# EAGLE design kinx (EAGLE 8.4.3)

## Sheet 1 of 4: keyboard matrix
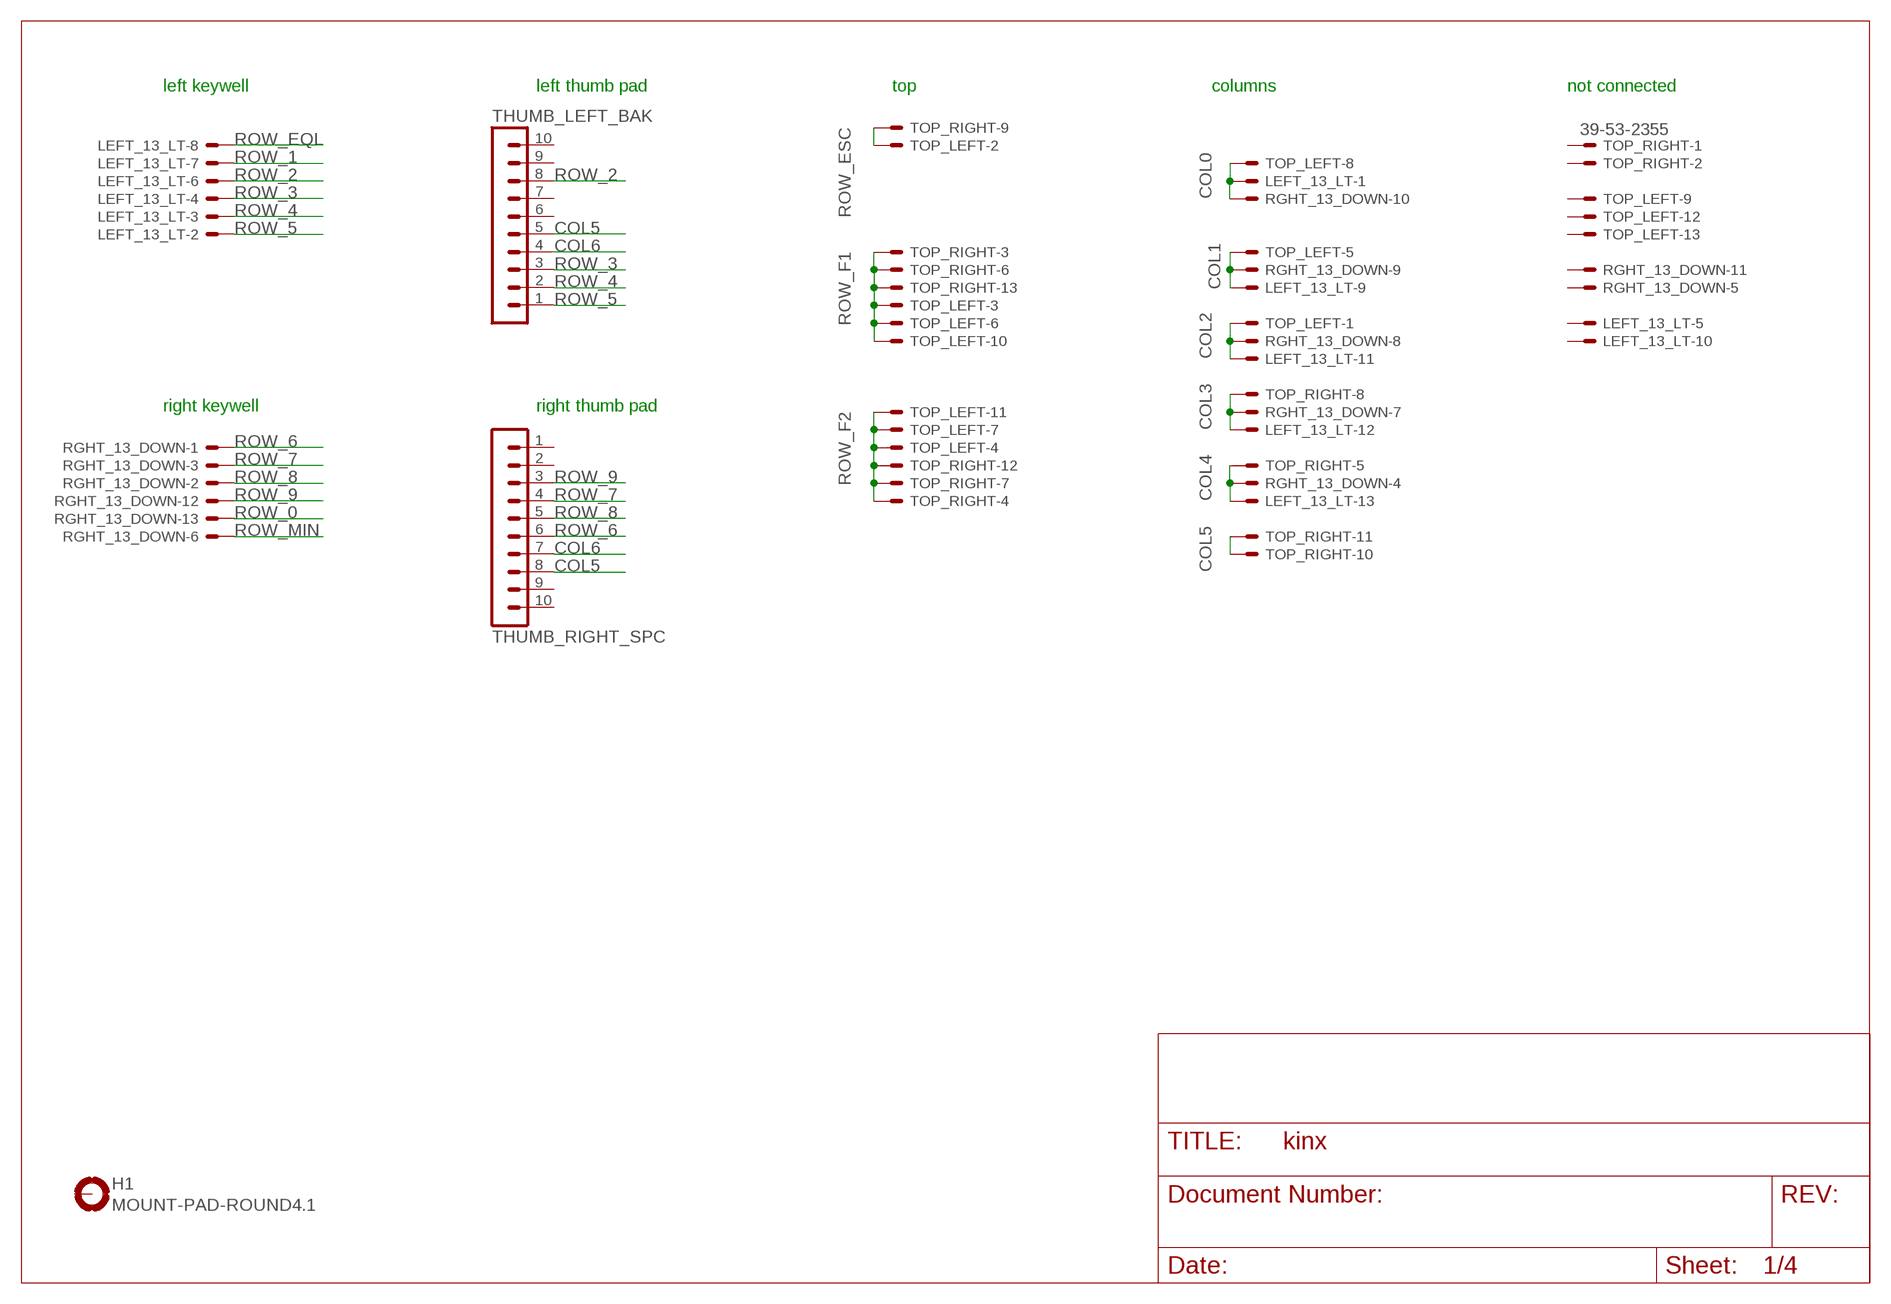
[diagram p0: schematic, sheet 1]

### Parts
H1  MOUNT-PAD-ROUND4.1  [4,1-PAD]
LEFT_13_LT  39-53-2355  [39-53-2135]
RGHT_13_DOWN  39-53-2355  [39-53-2135]
THUMB_LEFT_BAK  MA10-1  [MA10-1]
THUMB_RIGHT_SPC  MA10-1  [MA10-1]
TOP_LEFT  39-53-2355  [39-53-2135]
TOP_RIGHT  39-53-2355  [39-53-2135]

### Nets
COL0: LEFT_13_LT.P$1 RGHT_13_DOWN.P$10 TOP_LEFT.P$8 ; also sheet 3
COL1: LEFT_13_LT.P$9 RGHT_13_DOWN.P$9 TOP_LEFT.P$5 ; also sheet 3
COL2: LEFT_13_LT.P$11 RGHT_13_DOWN.P$8 TOP_LEFT.P$1 ; also sheet 3
COL3: LEFT_13_LT.P$12 RGHT_13_DOWN.P$7 TOP_RIGHT.P$8 ; also sheet 3
COL4: LEFT_13_LT.P$13 RGHT_13_DOWN.P$4 TOP_RIGHT.P$5 ; also sheet 3
COL5: THUMB_LEFT_BAK.5 THUMB_RIGHT_SPC.8 TOP_RIGHT.P$10 TOP_RIGHT.P$11 ; also sheet 3
COL6: THUMB_LEFT_BAK.4 THUMB_RIGHT_SPC.7 ; also sheet 3
ROW_0: RGHT_13_DOWN.P$13 ; also sheet 3
ROW_1: LEFT_13_LT.P$7 ; also sheet 3
ROW_2: LEFT_13_LT.P$6 THUMB_LEFT_BAK.8 ; also sheet 3
ROW_3: LEFT_13_LT.P$4 THUMB_LEFT_BAK.3 ; also sheet 3
ROW_4: LEFT_13_LT.P$3 THUMB_LEFT_BAK.2 ; also sheet 3
ROW_5: LEFT_13_LT.P$2 THUMB_LEFT_BAK.1 ; also sheet 3
ROW_6: RGHT_13_DOWN.P$1 THUMB_RIGHT_SPC.6 ; also sheet 3
ROW_7: RGHT_13_DOWN.P$3 THUMB_RIGHT_SPC.4 ; also sheet 3
ROW_8: RGHT_13_DOWN.P$2 THUMB_RIGHT_SPC.5 ; also sheet 3
ROW_9: RGHT_13_DOWN.P$12 THUMB_RIGHT_SPC.3 ; also sheet 3
ROW_EQL: LEFT_13_LT.P$8 ; also sheet 3
ROW_ESC: TOP_LEFT.P$2 TOP_RIGHT.P$9 ; also sheet 3
ROW_F1: TOP_LEFT.P$3 TOP_LEFT.P$6 TOP_LEFT.P$10 TOP_RIGHT.P$3 TOP_RIGHT.P$6 TOP_RIGHT.P$13 ; also sheet 3
ROW_F2: TOP_LEFT.P$4 TOP_LEFT.P$7 TOP_LEFT.P$11 TOP_RIGHT.P$4 TOP_RIGHT.P$7 TOP_RIGHT.P$12 ; also sheet 3
ROW_MIN: RGHT_13_DOWN.P$6 ; also sheet 3
Unconnected: H1.B4,1(MOUNT) LEFT_13_LT.P$5 LEFT_13_LT.P$10 RGHT_13_DOWN.P$5 RGHT_13_DOWN.P$11 THUMB_LEFT_BAK.6 THUMB_LEFT_BAK.7 THUMB_LEFT_BAK.9 THUMB_LEFT_BAK.10 THUMB_RIGHT_SPC.1 THUMB_RIGHT_SPC.2 THUMB_RIGHT_SPC.9 THUMB_RIGHT_SPC.10 TOP_LEFT.P$9 TOP_LEFT.P$12 TOP_LEFT.P$13 TOP_RIGHT.P$1 TOP_RIGHT.P$2

### Notes on the sheet
- left keywell | left thumb pad | top | columns | not connected
- right keywell | right thumb pad

## Sheet 2 of 4: LEDs
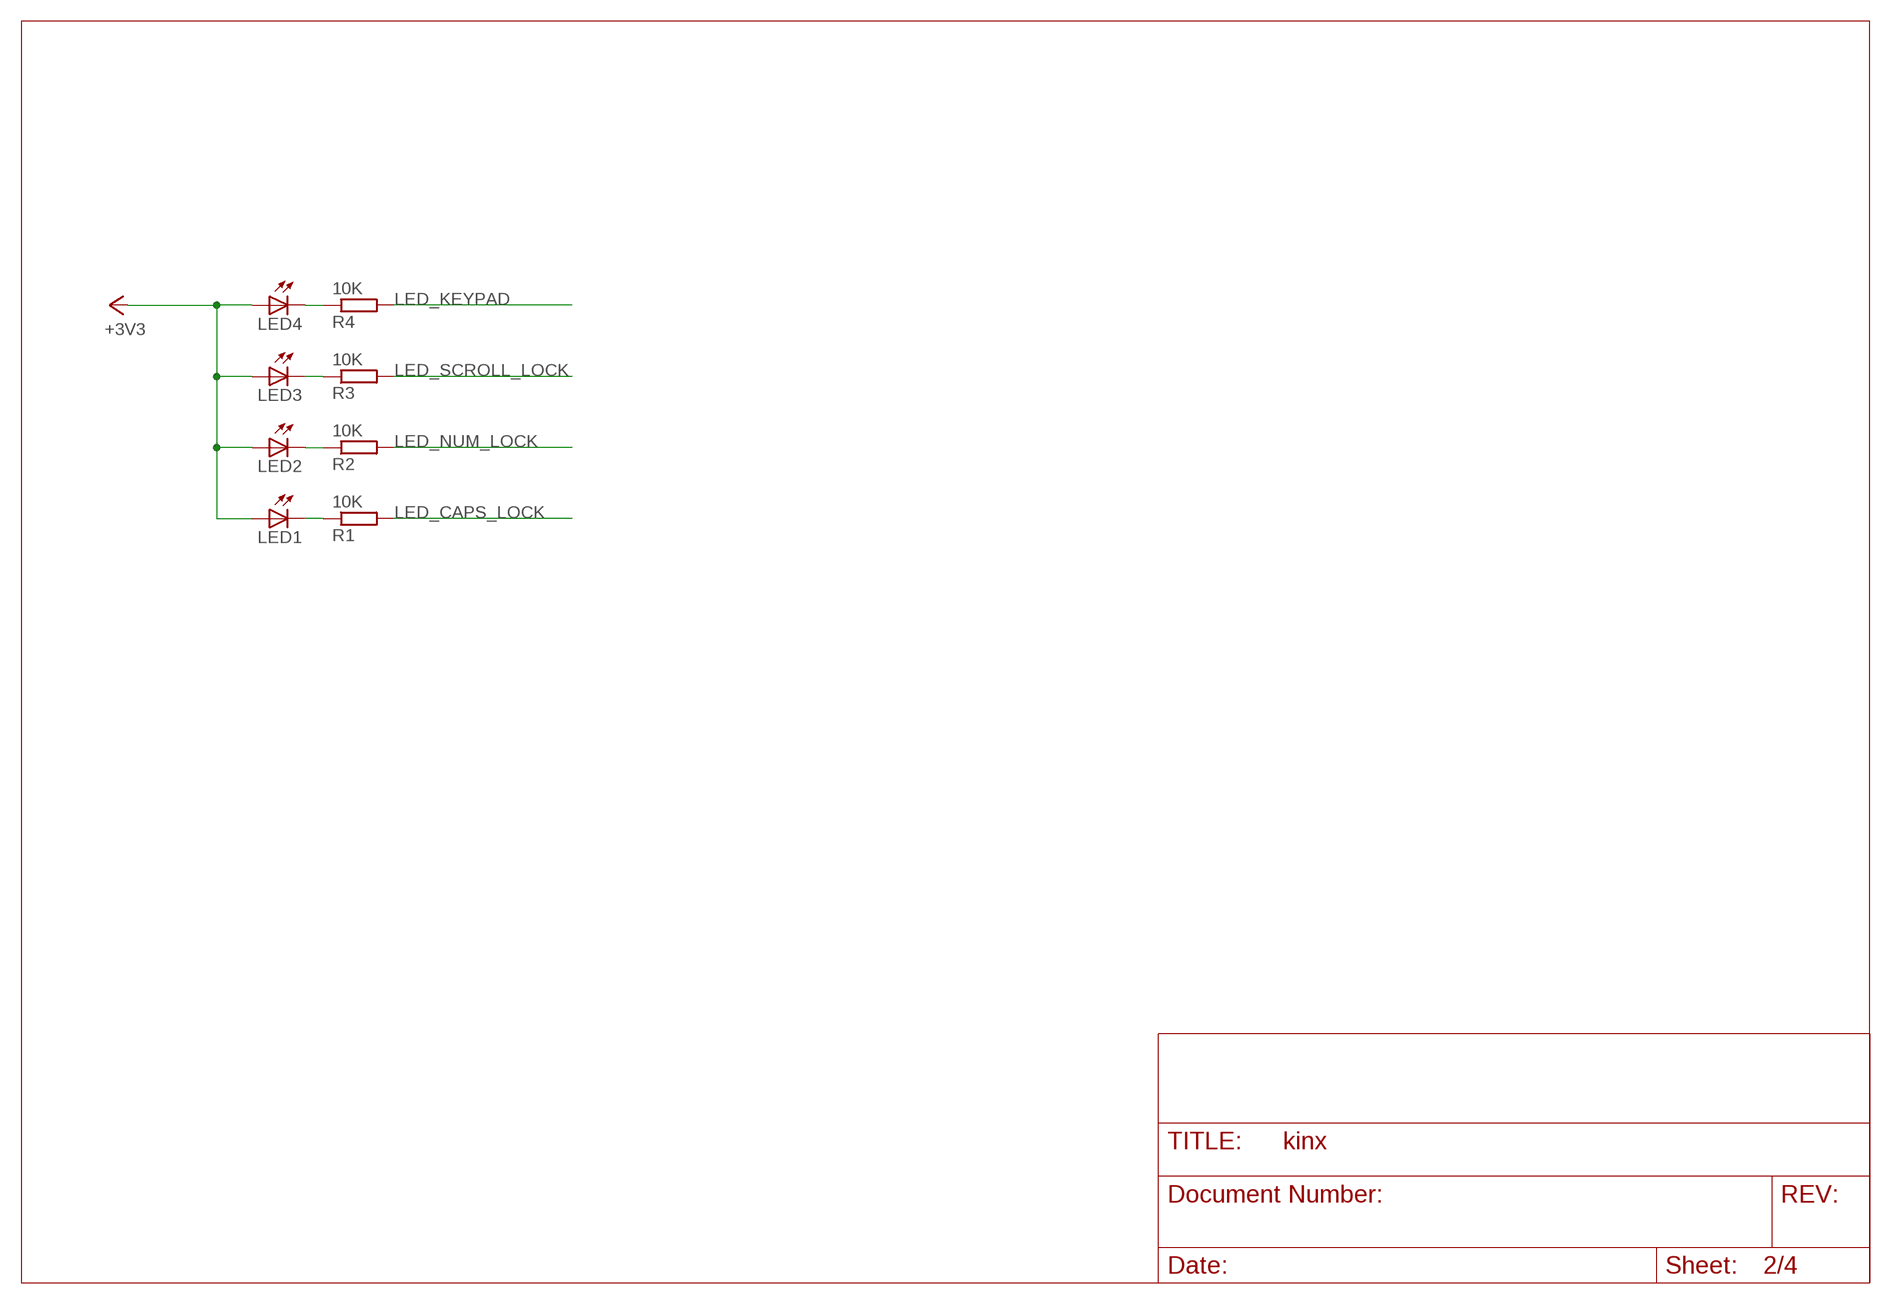
[diagram p1: schematic, sheet 2]

### Parts
LED1  LEDSML1206  [SML1206]
LED2  LEDSML1206  [SML1206]
LED3  LEDSML1206  [SML1206]
LED4  LEDSML1206  [SML1206]
R1  10K  R-EU_R1206  [R1206]
R2  10K  R-EU_R1206  [R1206]
R3  10K  R-EU_R1206  [R1206]
R4  10K  R-EU_R1206  [R1206]

### Nets
+3V3 [power]: LED1.A LED2.A LED3.A LED4.A ; also sheet 3,4
LED_CAPS_LOCK: R1.2 ; also sheet 3
LED_KEYPAD: R4.2 ; also sheet 3
LED_NUM_LOCK: R2.2 ; also sheet 3
LED_SCROLL_LOCK: R3.2 ; also sheet 3
N$14: LED4.C R4.1
N$15: LED3.C R3.1
N$16: LED2.C R2.1
N$17: LED1.C R1.1

## Sheet 3 of 4: microcontroller
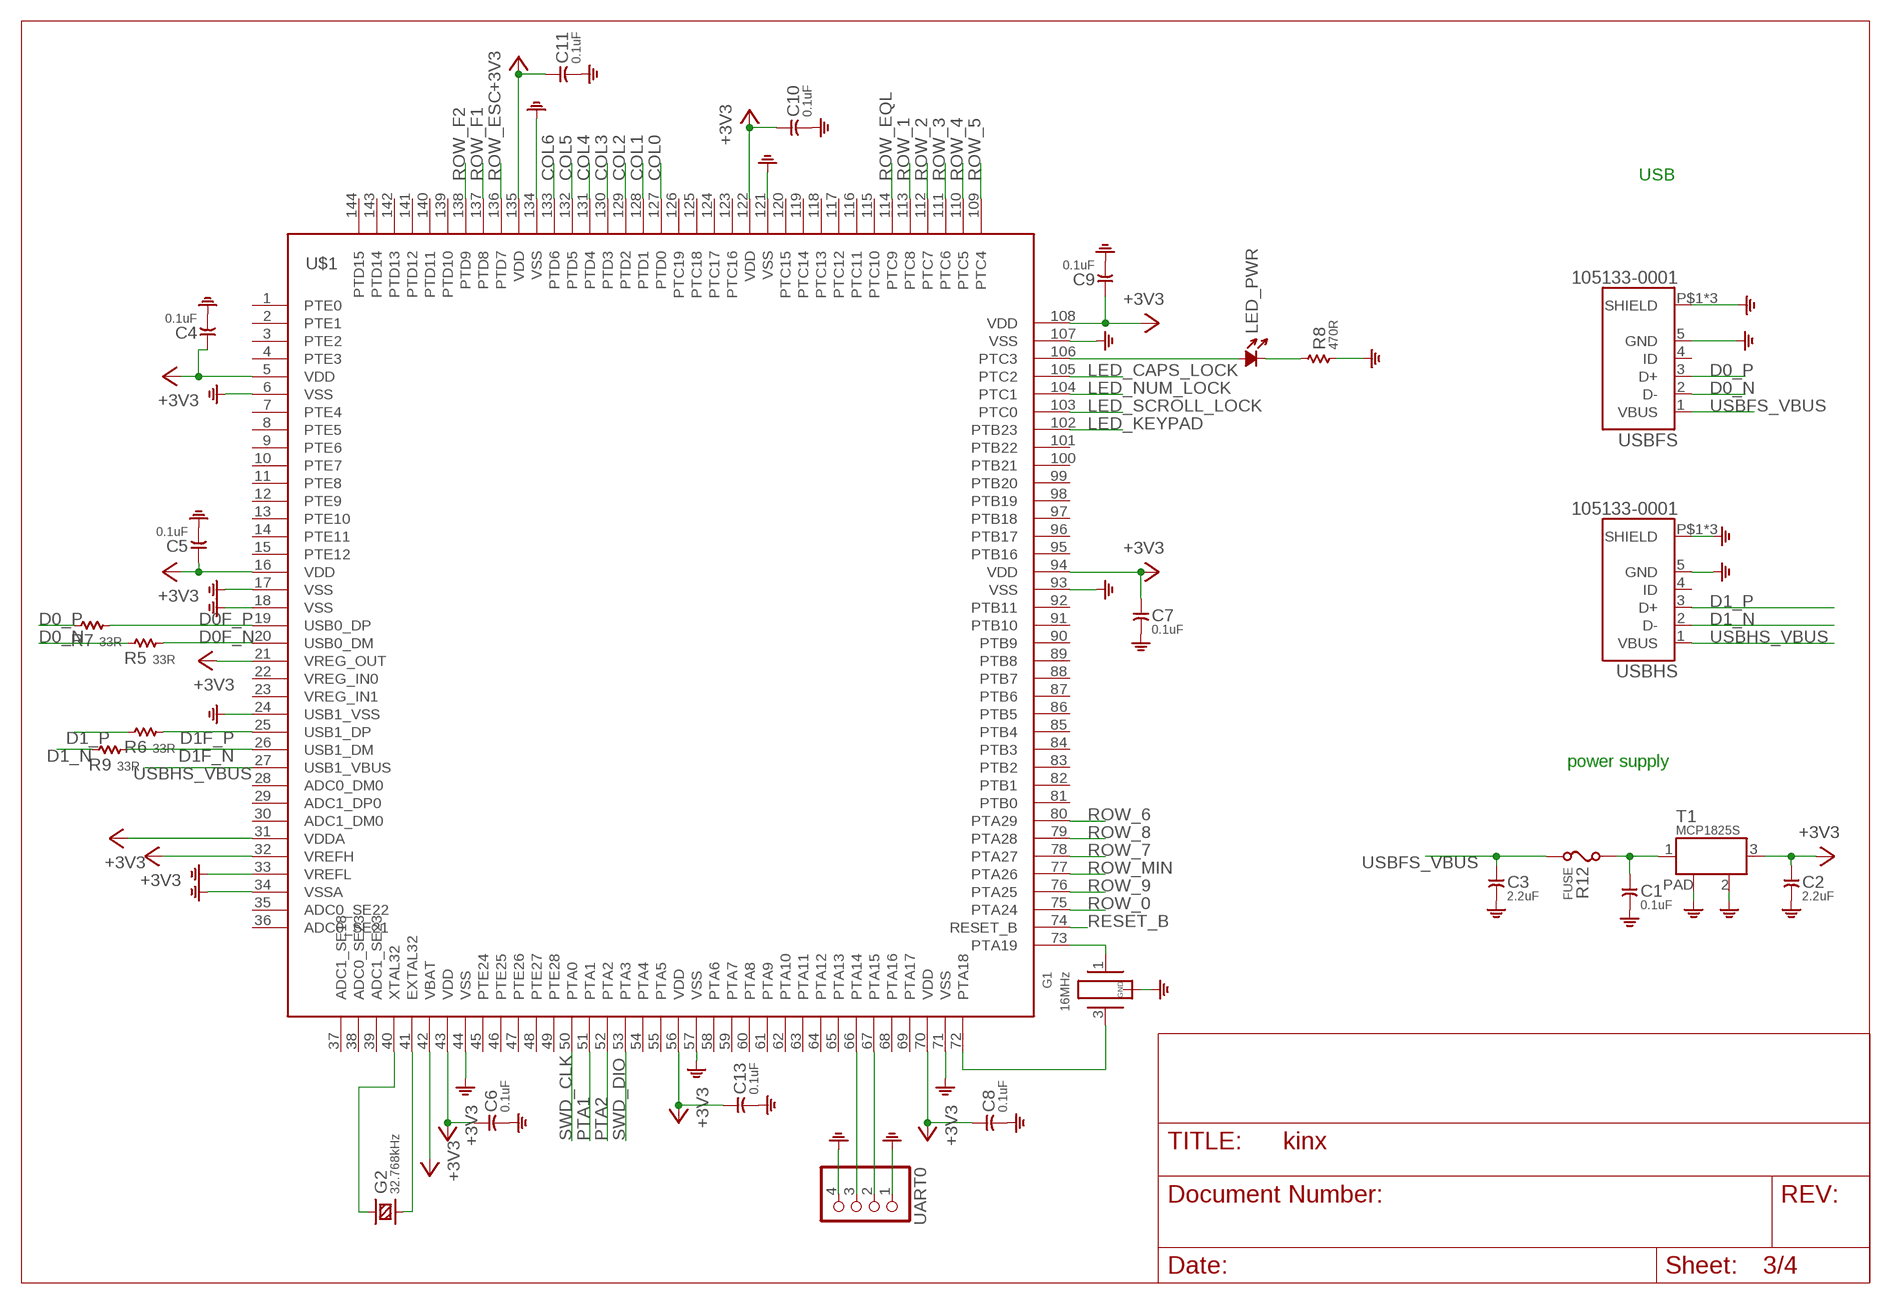
[diagram p2: schematic, sheet 3]

### Parts
C1  0.1uF  CAPACITOR-0.1UF  [C0603]
C2  2.2uF  CAPACITOR-2.2UF  [C0805]
C3  2.2uF  CAPACITOR-2.2UF  [C0805]
C4  0.1uF  CAPACITOR-0.1UF  [C0603]
C5  0.1uF  CAPACITOR-0.1UF  [C0603]
C6  0.1uF  CAPACITOR-0.1UF  [C0603]
C7  0.1uF  CAPACITOR-0.1UF  [C0603]
C8  0.1uF  CAPACITOR-0.1UF  [C0603]
C9  0.1uF  CAPACITOR-0.1UF  [C0603]
C10  0.1uF  CAPACITOR-0.1UF  [C0603]
C11  0.1uF  CAPACITOR-0.1UF  [C0603]
C13  0.1uF  CAPACITOR-0.1UF  [C0603]
G1  16MHz  FH1600015  [FHXXX]
G2  32.768kHz  CRYSTAL-TC26H  [TC26H]
LED_PWR  LED  [LED-0805]
R5  33R  RESISTOR-33R  [R0603]
R6  33R  RESISTOR-33R  [R0603]
R7  33R  RESISTOR-33R  [R0603]
R8  470R  RESISTOR-470R  [R0603]
R9  33R  RESISTOR-33R  [R0603]
R12  FUSE  [F0805]
T1  MCP1825S  LDO  [SOT-223]
U$1  MK66FX1M0VLQ18  [TQFP144]
UART0  PINHD-1X4/90  [1X04/90]
USBFS  105133-0001  [MOLEX_105133-0001]
USBHS  105133-0001  [MOLEX_105133-0001]

### Nets
+3V3 [power]: C2.1 C4.1 C5.1 C6.1 C7.1 C8.1 C9.1 C10.1 C11.1 C13.1 T1.3(OUT) U$1.5(VDD) U$1.16(VDD) U$1.21(VREG_OUT) U$1.31(VDDA) U$1.32(VREFH) U$1.42(VBAT) U$1.43(VDD) U$1.56(VDD) U$1.70(VDD) U$1.94(VDD) U$1.108(VDD) U$1.122(VDD) U$1.135(VDD) ; also sheet 2,4
COL0: U$1.127(PTD0) ; also sheet 1
COL1: U$1.128(PTD1) ; also sheet 1
COL2: U$1.129(PTD2) ; also sheet 1
COL3: U$1.130(PTD3) ; also sheet 1
COL4: U$1.131(PTD4) ; also sheet 1
COL5: U$1.132(PTD5) ; also sheet 1
COL6: U$1.133(PTD6) ; also sheet 1
D0_N [USB]: R5.1 USBFS.2(D-)
D0_P [USB]: R7.1 USBFS.3(D+)
D0F_N [USB]: R5.2 U$1.20(USB0_DM)
D0F_P [USB]: R7.2 U$1.19(USB0_DP)
D1_N [USB]: R9.1 USBHS.2(D-)
D1_P [USB]: R6.1 USBHS.3(D+)
D1F_N [USB]: R9.2 U$1.26(USB1_DM)
D1F_P [USB]: R6.2 U$1.25(USB1_DP)
GND: C1.2 C2.2 C3.2 C4.2 C5.2 C6.2 C7.2 C8.2 C9.2 C10.2 C11.2 C13.2 G1.2(GND) G1.4(GND) R8.1 T1.2(GND) T1.PAD U$1.6(VSS) U$1.17(VSS) U$1.18(VSS) U$1.24(USB1_VSS) U$1.33(VREFL) U$1.34(VSSA) U$1.44(VSS) U$1.57(VSS) U$1.71(VSS) U$1.93(VSS) U$1.107(VSS) U$1.121(VSS) U$1.134(VSS) UART0.1 UART0.4 USBFS.5(GND) USBFS.P$1(SHIELD) USBFS.P$2(SHIELD) USBFS.P$3(SHIELD) USBHS.5(GND) USBHS.P$1(SHIELD) USBHS.P$2(SHIELD) USBHS.P$3(SHIELD) ; also sheet 4
LED_CAPS_LOCK: U$1.105(PTC2) ; also sheet 2
LED_KEYPAD: U$1.102(PTB23) ; also sheet 2
LED_NUM_LOCK: U$1.104(PTC1) ; also sheet 2
LED_SCROLL_LOCK: U$1.103(PTC0) ; also sheet 2
N$7 [power]: C1.1 R12.2 T1.1(IN)
N$18: G1.1 U$1.73(PTA19)
N$19: G1.3 U$1.72(PTA18)
N$20: G2.2 U$1.40(XTAL32)
N$21: G2.1 U$1.41(EXTAL32)
N$41: LED_PWR.+ U$1.106(PTC3)
N$80: LED_PWR.- R8.2
PTA1: U$1.51(PTA1) ; also sheet 4
PTA2: U$1.52(PTA2) ; also sheet 4
RESET_B: U$1.74(RESET_B) ; also sheet 4
ROW_0: U$1.75(PTA24) ; also sheet 1
ROW_1: U$1.113(PTC8) ; also sheet 1
ROW_2: U$1.112(PTC7) ; also sheet 1
ROW_3: U$1.111(PTC6) ; also sheet 1
ROW_4: U$1.110(PTC5) ; also sheet 1
ROW_5: U$1.109(PTC4) ; also sheet 1
ROW_6: U$1.80(PTA29) ; also sheet 1
ROW_7: U$1.78(PTA27) ; also sheet 1
ROW_8: U$1.79(PTA28) ; also sheet 1
ROW_9: U$1.76(PTA25) ; also sheet 1
ROW_EQL: U$1.114(PTC9) ; also sheet 1
ROW_ESC: U$1.136(PTD7) ; also sheet 1
ROW_F1: U$1.137(PTD8) ; also sheet 1
ROW_F2: U$1.138(PTD9) ; also sheet 1
ROW_MIN: U$1.77(PTA26) ; also sheet 1
RX: U$1.67(PTA15) UART0.2
SWD_CLK: U$1.50(PTA0) ; also sheet 4
SWD_DIO: U$1.53(PTA3) ; also sheet 4
TX: U$1.66(PTA14) UART0.3
USBFS_VBUS [power]: C3.1 R12.1 USBFS.1(VBUS)
USBHS_VBUS: U$1.27(USB1_VBUS) USBHS.1(VBUS)
Unconnected: U$1.1(PTE0) U$1.2(PTE1) U$1.3(PTE2) U$1.4(PTE3) U$1.7(PTE4) U$1.8(PTE5) U$1.9(PTE6) U$1.10(PTE7) U$1.11(PTE8) U$1.12(PTE9) U$1.13(PTE10) U$1.14(PTE11) U$1.15(PTE12) U$1.28(ADC0_DM0) U$1.29(ADC1_DP0) U$1.30(ADC1_DM0) U$1.35(ADC0_SE22) U$1.36(ADC0_SE21) U$1.37(ADC1_SE18) U$1.38(ADC0_SE23) U$1.39(ADC1_SE23) U$1.45(PTE24) U$1.46(PTE25) U$1.47(PTE26) U$1.48(PTE27) U$1.49(PTE28) U$1.54(PTA4) U$1.55(PTA5) U$1.58(PTA6) U$1.59(PTA7) U$1.60(PTA8) U$1.61(PTA9) U$1.62(PTA10) U$1.63(PTA11) U$1.64(PTA12) U$1.65(PTA13) U$1.68(PTA16) U$1.69(PTA17) U$1.81(PTB0) U$1.82(PTB1) U$1.83(PTB2) U$1.84(PTB3) U$1.85(PTB4) U$1.86(PTB5) U$1.87(PTB6) U$1.88(PTB7) U$1.89(PTB8) U$1.90(PTB9) U$1.91(PTB10) U$1.92(PTB11) U$1.95(PTB16) U$1.96(PTB17) U$1.97(PTB18) U$1.98(PTB19) U$1.99(PTB20) U$1.100(PTB21) U$1.101(PTB22) U$1.115(PTC10) U$1.116(PTC11) U$1.117(PTC12) U$1.118(PTC13) U$1.119(PTC14) U$1.120(PTC15) U$1.123(PTC16) U$1.124(PTC17) U$1.125(PTC18) U$1.126(PTC19) U$1.139(PTD10) U$1.140(PTD11) U$1.141(PTD12) U$1.142(PTD13) U$1.143(PTD14) U$1.144(PTD15) USBFS.4(ID) USBHS.4(ID)

### Notes on the sheet
- USB
- power supply

## Sheet 4 of 4: teensy programming IC
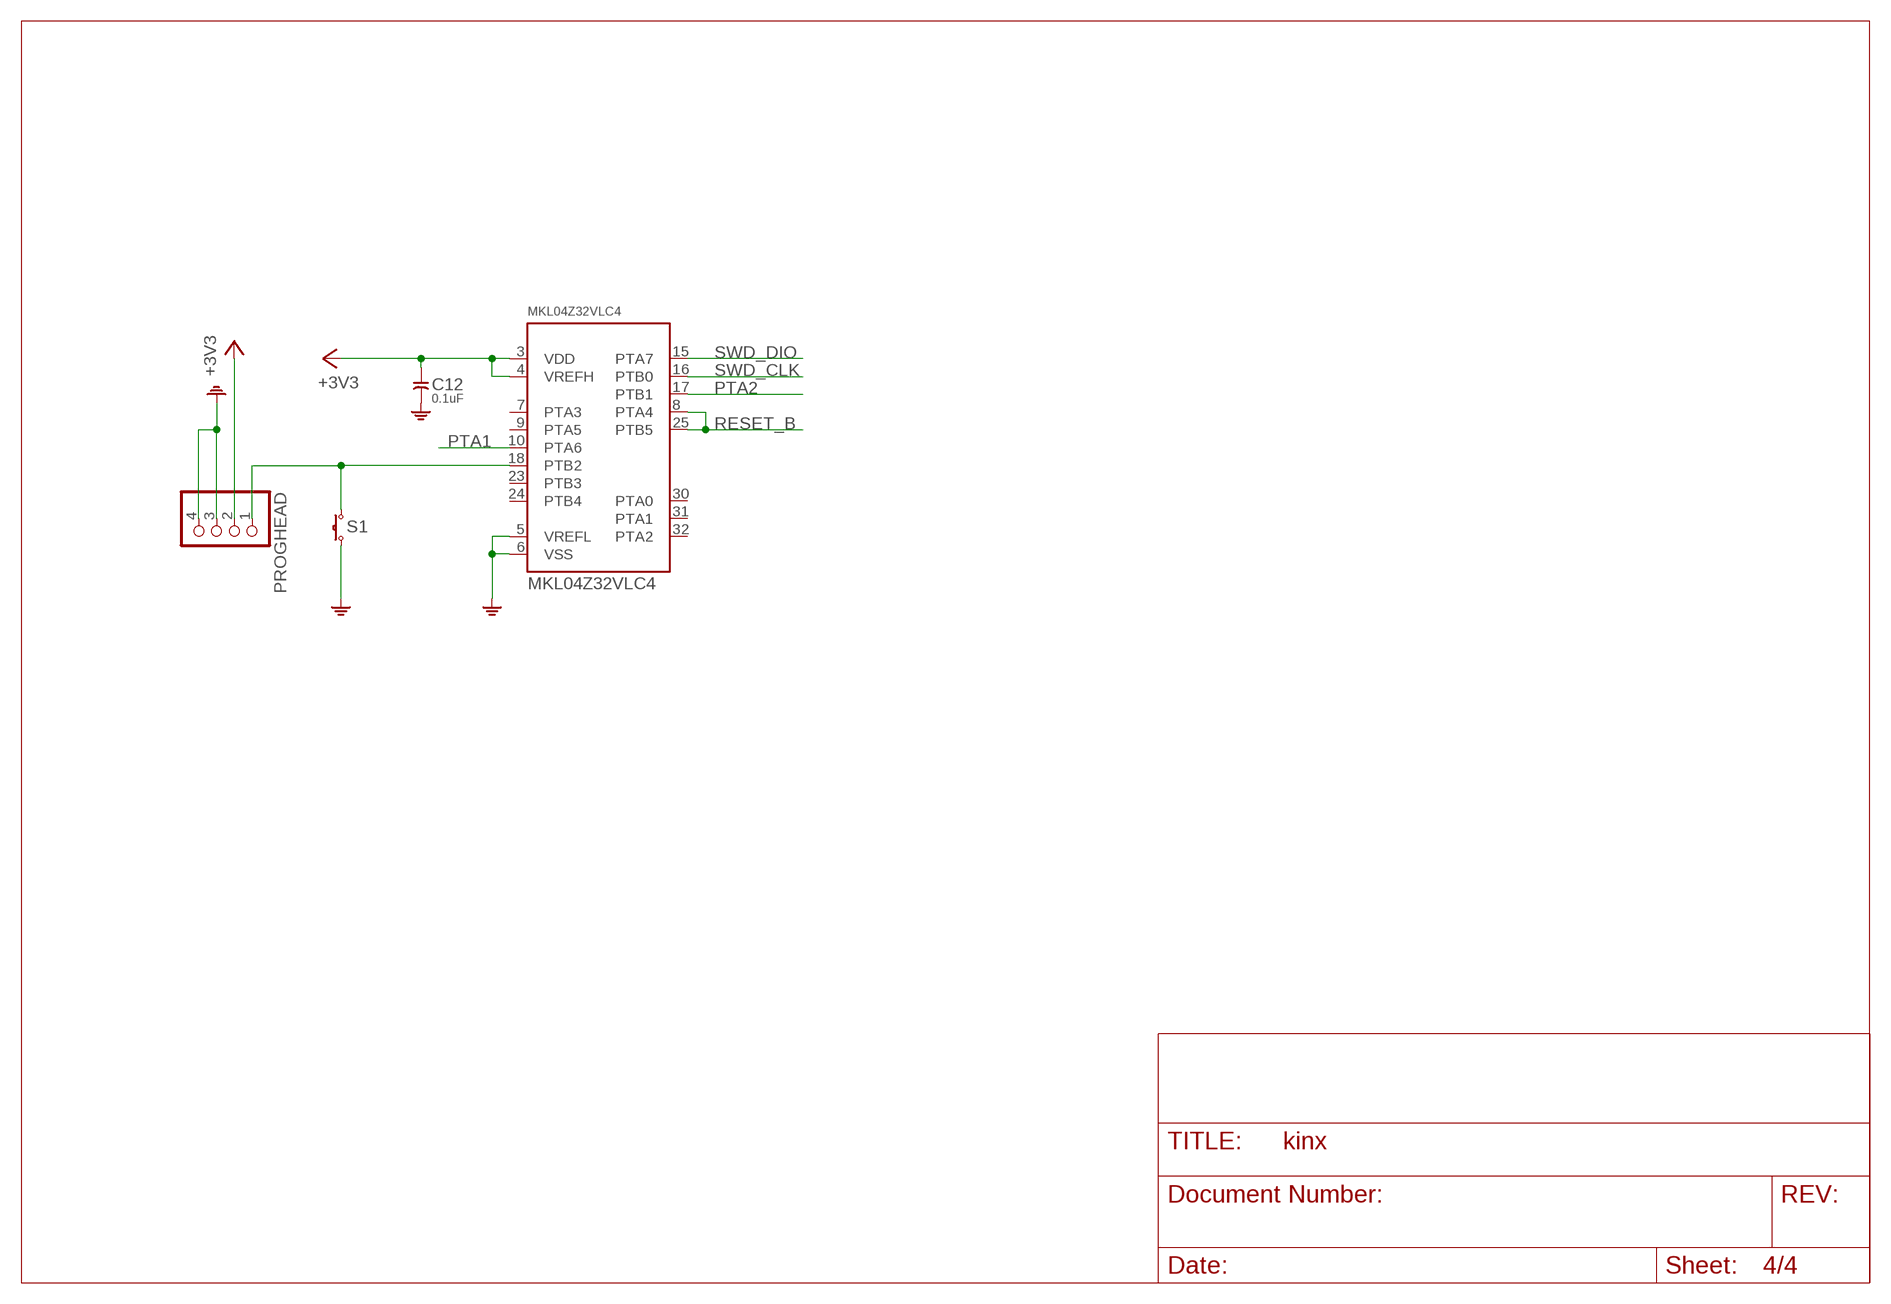
[diagram p3: schematic, sheet 4]

### Parts
C12  0.1uF  CAPACITOR-0.1UF  [C0603]
MKL04Z32VLC4  MKL04Z32VLC4  [LQFP32-08]
PROGHEAD  PINHD-1X4/90  [1X04/90]
S1  TACT_SWITCH  [ALPS_SKHH]

### Nets
+3V3 [power]: C12.1 MKL04Z32VLC4.3(VDD) MKL04Z32VLC4.4(VREFH) PROGHEAD.2 ; also sheet 2,3
GND: C12.2 MKL04Z32VLC4.5(VREFL) MKL04Z32VLC4.6(VSS) PROGHEAD.3 PROGHEAD.4 S1.3 S1.4 ; also sheet 3
N$70: MKL04Z32VLC4.18(PTB2) PROGHEAD.1 S1.1 S1.2
PTA1: MKL04Z32VLC4.10(PTA6) ; also sheet 3
PTA2: MKL04Z32VLC4.17(PTB1) ; also sheet 3
RESET_B: MKL04Z32VLC4.8(PTA4) MKL04Z32VLC4.25(PTB5) ; also sheet 3
SWD_CLK: MKL04Z32VLC4.16(PTB0) ; also sheet 3
SWD_DIO: MKL04Z32VLC4.15(PTA7) ; also sheet 3
Unconnected: MKL04Z32VLC4.7(PTA3) MKL04Z32VLC4.9(PTA5) MKL04Z32VLC4.23(PTB3) MKL04Z32VLC4.24(PTB4) MKL04Z32VLC4.30(PTA0) MKL04Z32VLC4.31(PTA1) MKL04Z32VLC4.32(PTA2)

## Power pins joined to a net without a drawn wire
VREG_IN0: U$1.22(VREG_IN0)
VREG_IN1: U$1.23(VREG_IN1)

## Library data of the parts
C1 C4-C13 = t32_ref:CAPACITOR-0.1UF; DESC: 0.1uF / 16VDC / X7R; MF: Murata Electronics; MPN: GRM188R71C104KA01D; OC_MOUSER: 80-C0603C104M4R7411; PACKAGE: 0603; TYPE: Capacitor
C2 C3 = t32_ref:CAPACITOR-2.2UF; DESC: 2.2uF / 25 VDC / X7R; MF: Taiyo Yuden; MPN: TMK212B7225KG-TR; OC_MOUSER: 963-TMK212B7225KG-TR; PACKAGE: 0805; TYPE: Capacitor
G1 = crystals:FH1600015: Pericom Type FH 16 MHz 2.5 x 2.0 mm; DIGIKEY: SER4068CT-ND; MANUFACTURER: Diodes Incorporated; MPN: FH1600015; OC_MOUSER: 729-FH1600015
G2 = t32_ref:CRYSTAL-; DESC: 32.768kHz / 12.5pF / 20ppm; MF: Citizen FineDevice; MPN: CFS206-32.768KDZF-UB; OC_MOUSER: 695-CFS206-327KF-U; PACKAGE: TC-26H; TYPE: Crystal
H1 = holes:MOUNT-PAD-ROUND: MOUNTING PAD, round
LED1-LED4 = led:LED: LED OSRAM: - CHIPLED LG R971, LG N971, LY N971, LG Q971, LY Q971, LO R971, LY R971 LH N974, LH R974 LS Q976, LO Q976, LY Q976 LO Q996 - Hyper CHIPLED LW Q18S LB Q993, LB Q99A, LB R99A - SideLED LS A670, LO A670, LY A670, LG A670, LP A670 LB A673, LV A673, LT A673, LW A673 LH A674 LY A675 LS A676, LA A676, LO A676, LY A676, LW A676 LS A679, LY A679, LG A679 - Hyper Micro SIDELED® LS Y876, LA Y876, LO Y876, LY Y876 LT Y87S - SmartLED LW L88C, LW L88S LB L89C, LB L89S, LG L890 LS L89K, LO L89K, LY L89K LS L896, LA L896, LO L896, LY L896 - TOPLED LS T670, LO T670, LY T670, LG T670, LP T670 LSG T670, LSP T670, LSY T670, LOP T670, LYG T670 LG T671, LOG T671, LSG T671 LB T673, LV T673, LT T673, LW T673 LH T674 LS T676, LA T676, LO T676, LY T676, LB T676, LH T676, LSB T676, LW T676 LB T67C, LV T67C, LT T67C, LS T67K, LO T67K, LY T67K, LW E67C LS E67B, LA E67B, LO E67B, LY E67B, LB E67C, LV E67C, LT E67C LW T67C LS T679, LY T679, LG T679 LS T770, LO T770, LY T770, LG T770, LP T770 LB T773, LV T773, LT T773, LW T773 LH T774 LS E675, LA E675, LY E675, LS T675 LS T776, LA T776, LO T776, LY T776, LB T776 LHGB T686 LT T68C, LB T68C - Hyper Mini TOPLED® LB M676 - Mini TOPLED Santana® LG M470 LS M47K, LO M47K, LY M47K Source: http://www.osram.convergy.de LUXEON: - LUMILED® LXK2-PW12-R00, LXK2-PW12-S00, LXK2-PW14-U00, LXK2-PW14-V00 LXK2-PM12-R00, LXK2-PM12-S00, LXK2-PM14-U00 LXK2-PE12-Q00, LXK2-PE12-R00, LXK2-PE12-S00, LXK2-PE14-T00, LXK2-PE14-U00 LXK2-PB12-K00, LXK2-PB12-L00, LXK2-PB12-M00, LXK2-PB14-N00, LXK2-PB14-P00, LXK2-PB14-Q00 LXK2-PR12-L00, LXK2-PR12-M00, LXK2-PR14-Q00, LXK2-PR14-R00 LXK2-PD12-Q00, LXK2-PD12-R00, LXK2-PD12-S00 LXK2-PH12-R00, LXK2-PH12-S00 LXK2-PL12-P00, LXK2-PL12-Q00, LXK2-PL12-R00 Source: www.luxeon.com KINGBRIGHT: KA-3528ASYC Source: www.kingbright.com; OC_MOUSER: 604-APT3216QBC/D
LED_PWR = t32_ref:LED; DESC: orange; MF: ROHM Semiconductor; MPN: SML-211DTT86; OC_MOUSER: 755-SML-211DTT86; PACKAGE: 0805; TYPE: LED
LEFT_13_LT RGHT_13_DOWN TOP_LEFT TOP_RIGHT = con-molex-39-53:39-53-2355; DIGIKEY: WM14526-ND; OC_MOUSER: 538-39-53-2135
MKL04Z32VLC4 = t32_ref:MKL04Z32VLC4; DESC: MKL04Z32VLC4 (preprogrammed); MF: PJRC; MPN: IC_MKL04Z32_TQFP32; PACKAGE: LQFP-32; TYPE: Microcontroller
PROGHEAD UART0 = pinhead:PINHD-1X4: PIN HEADER; OC_MOUSER: 649-68016-404HLF
R1-R4 = rcl:R-EU_: RESISTOR, European symbol; OC_MOUSER: 603-RC1206FR-0710KL
R5-R7 R9 = t32_ref:RESISTOR-33R; DESC: 33R / 1% / 0.25 W; MF: Panasonic; MPN: ERJ-PA3F33R0V; OC_MOUSER: 667-ERJ-PA3F33R0V; PACKAGE: 0603; TYPE: Resistor
R8 = t32_ref:RESISTOR-470R; DESC: 470R / 1 % / 0.1 W; MF: Vishay; MPN: CRCW0603470RFKEA; OC_MOUSER: 71-CRCW0603-470-E3; PACKAGE: 0603; TYPE: Resistor
R12 = t32_ref:FUSE; DESC: 6V / 0.5A; DIGIKEY: 507-1813-1-ND; MF: Bel Fuse; MPN: 0ZCK0050FF2E; OC_MOUSER: 530-0ZCK0050FF2E; PACKAGE: 0805; TYPE: PPTC
S1 = t32_ref:TACT_SWITCH; DESC: SPST; MF: ALPS; MPN: SKHHPKA010; OC_MOUSER: 688-SKHHPK; PACKAGE: 6x6x5 MM; TYPE: Tactile switch
T1 = t32_ref:LDO; DESC: 3.3V 500mA; DIGIKEY: MCP1825S-3302E/DB-ND; MF: Microchip Technology; MPN: MCP1825S-3302E/DB; OC_MOUSER: 579-MCP1825S-3302EDB; PACKAGE: SOT-223-3; TYPE: Voltage regulator
THUMB_LEFT_BAK THUMB_RIGHT_SPC = con-lstb:MA10-1: PIN HEADER; OC_FARNELL: unknown; OC_MOUSER: 538-22-28-4100; OC_NEWARK: unknown
U$1 = mk66fx1m0vmd18:MK66FX1M0VLQ18; DIGIKEY: 568-13334-ND; OC_MOUSER: 841-MK66FX1M0VLQ18
USBFS USBHS = molex-105133-0001:105133-0001: Conn Micro USB Type B RCP 5 POS 0.65mm Solder RA SMD 5 Terminal 1 Port Embossed T/R; AVAILABILITY: Good; DESCRIPTION: Conn Micro USB Type B RCP 5 POS 0.65mm Solder RA SMD 5 Terminal 1 Port Embossed T/R; DIGIKEY: WM10134CT-ND; MF: Molex; MP: 105133-0011; OC_MOUSER: 538-105133-0011; PACKAGE: None; PRICE: 0.48 USD

## Net classes
1 USB: width 0.35 mm, clearance 0.5 mm
2 power: width 0.4 mm

## Board
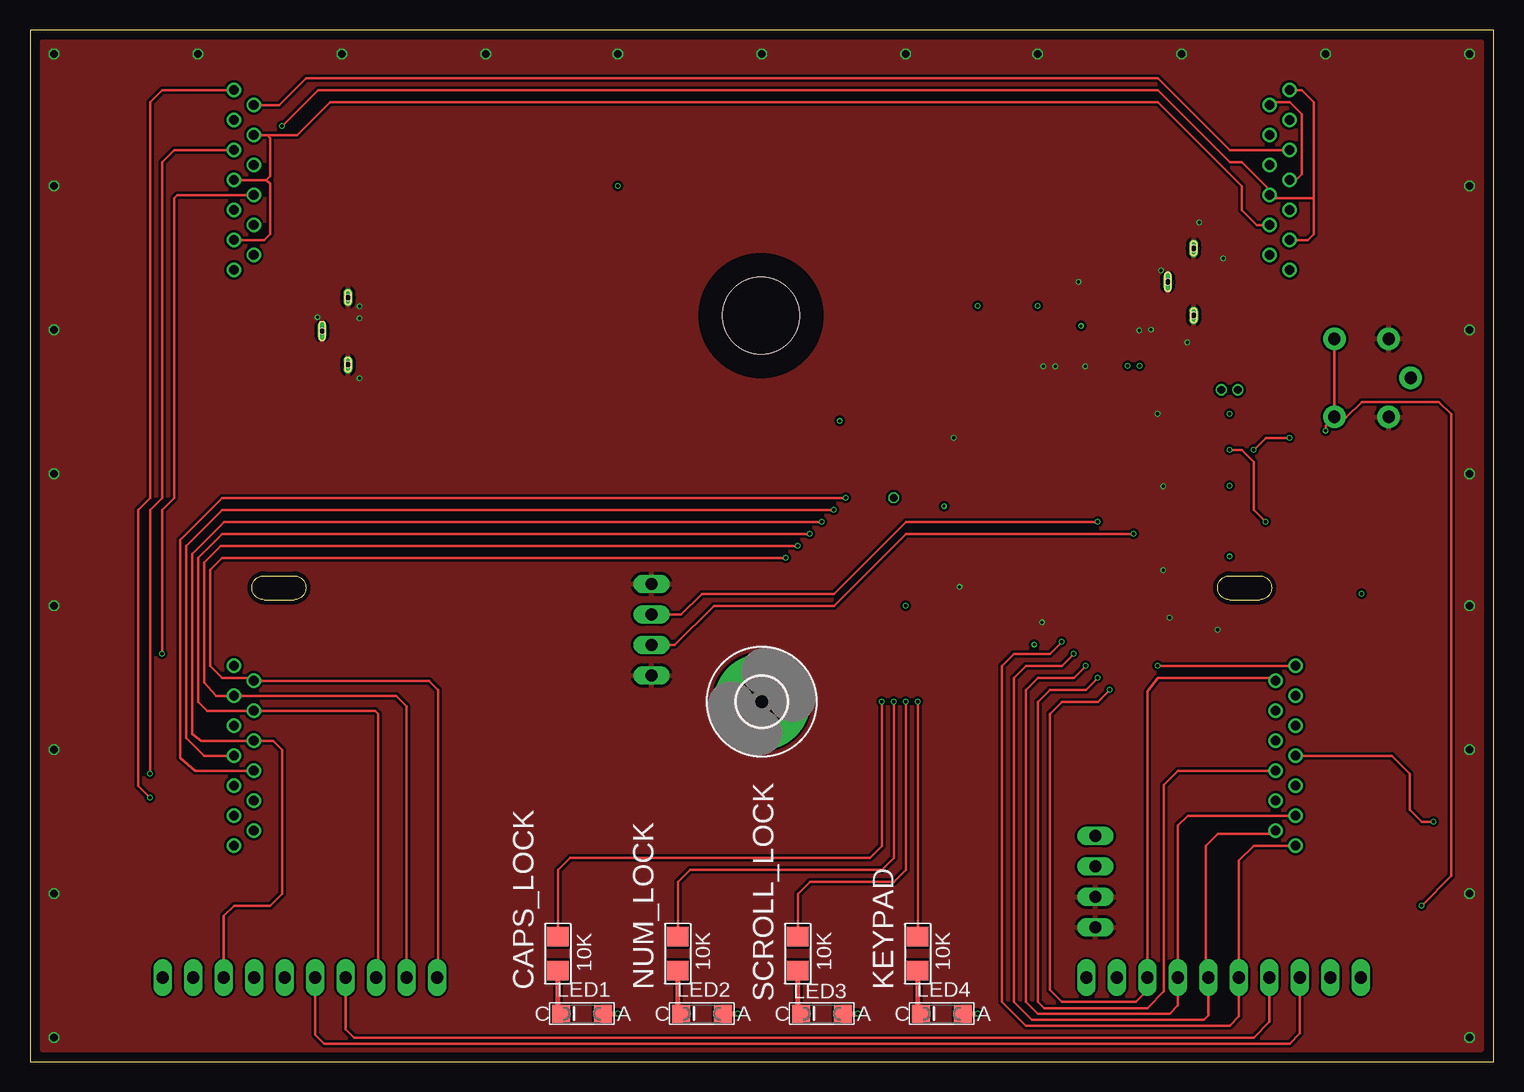
[diagram p4: board, top side]
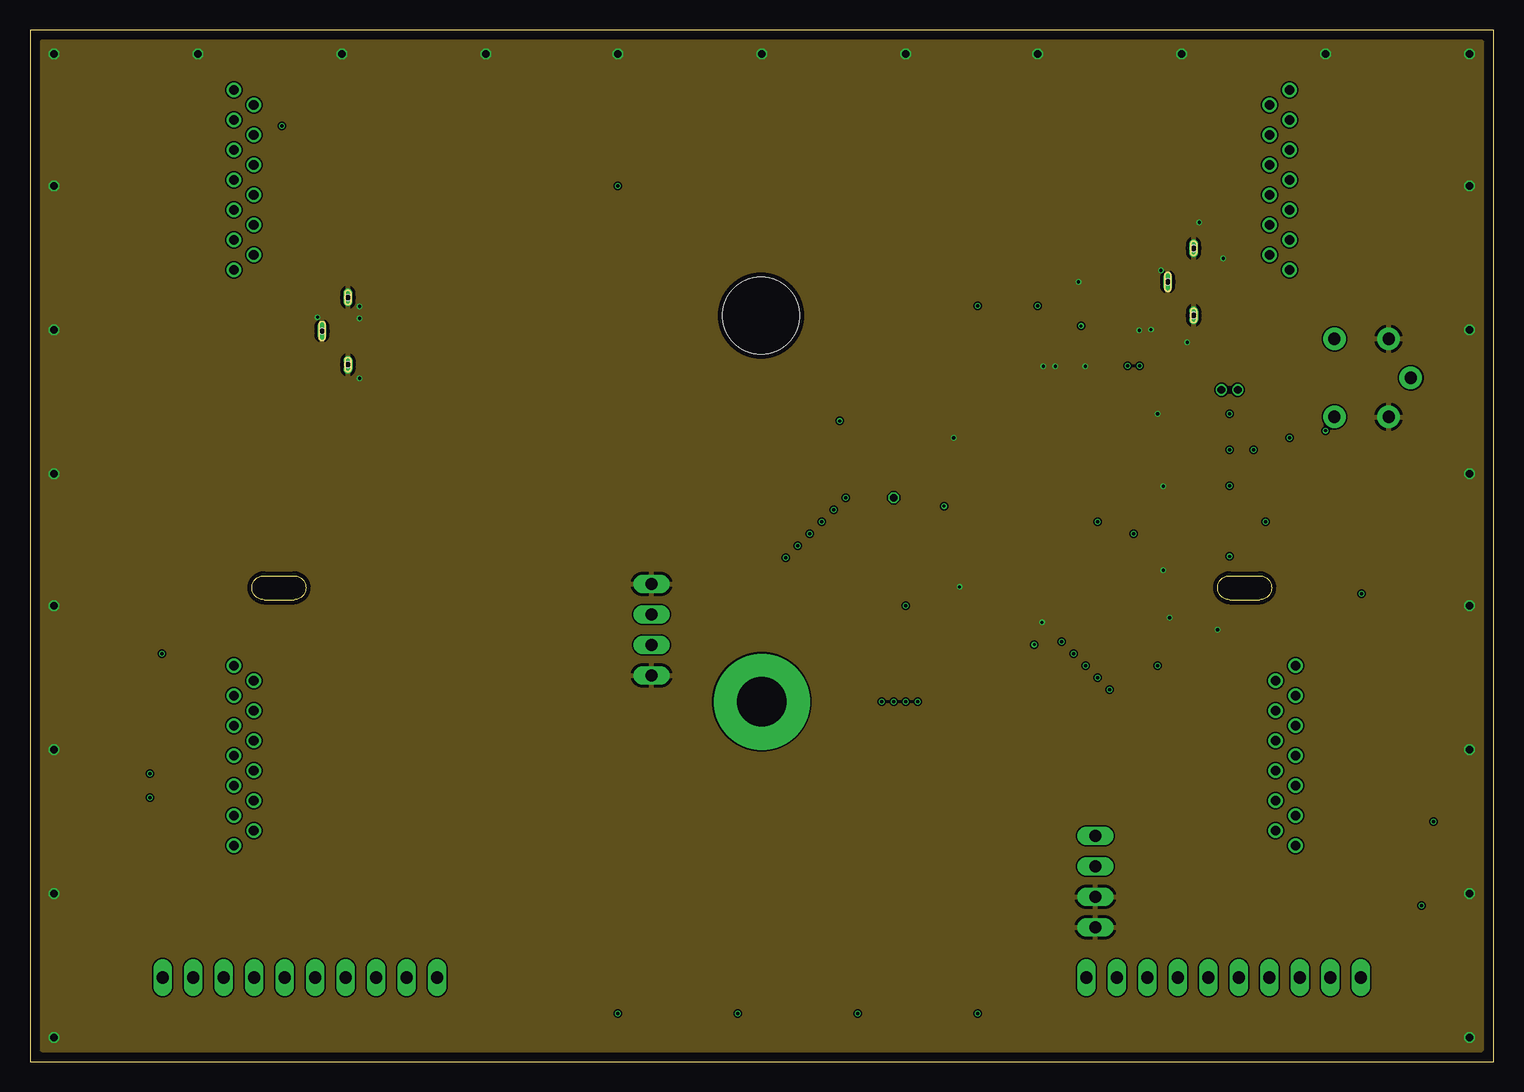
[diagram p5: board, inner layer Route2]
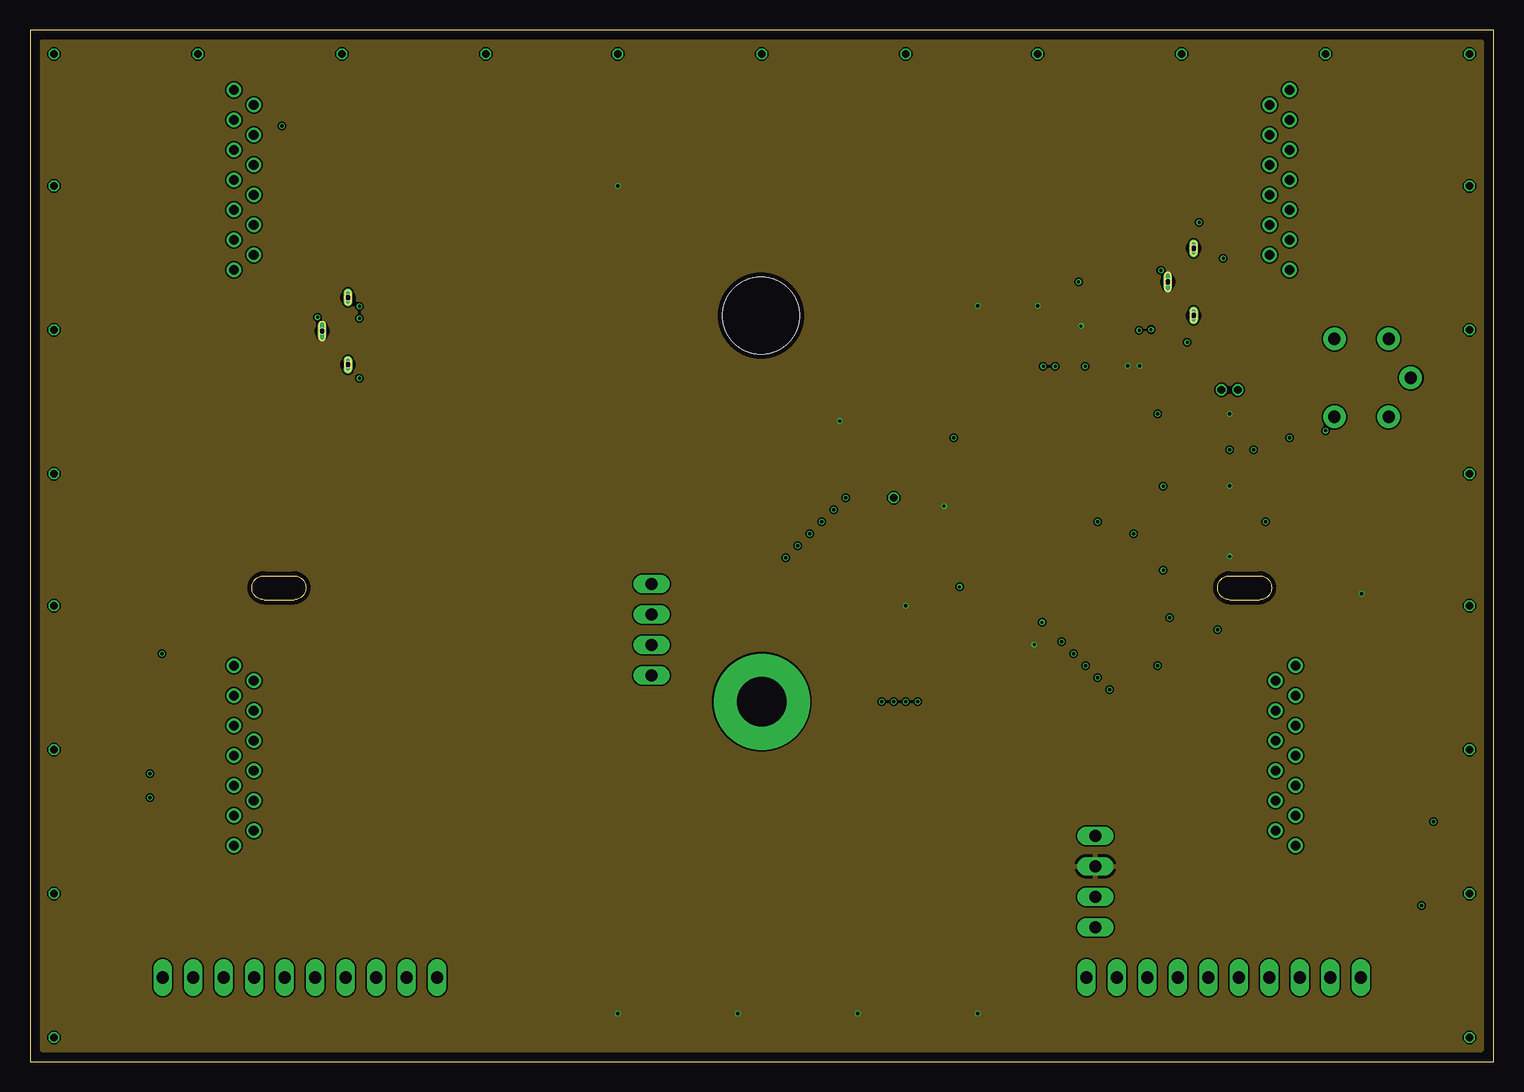
[diagram p6: board, inner layer Route15]
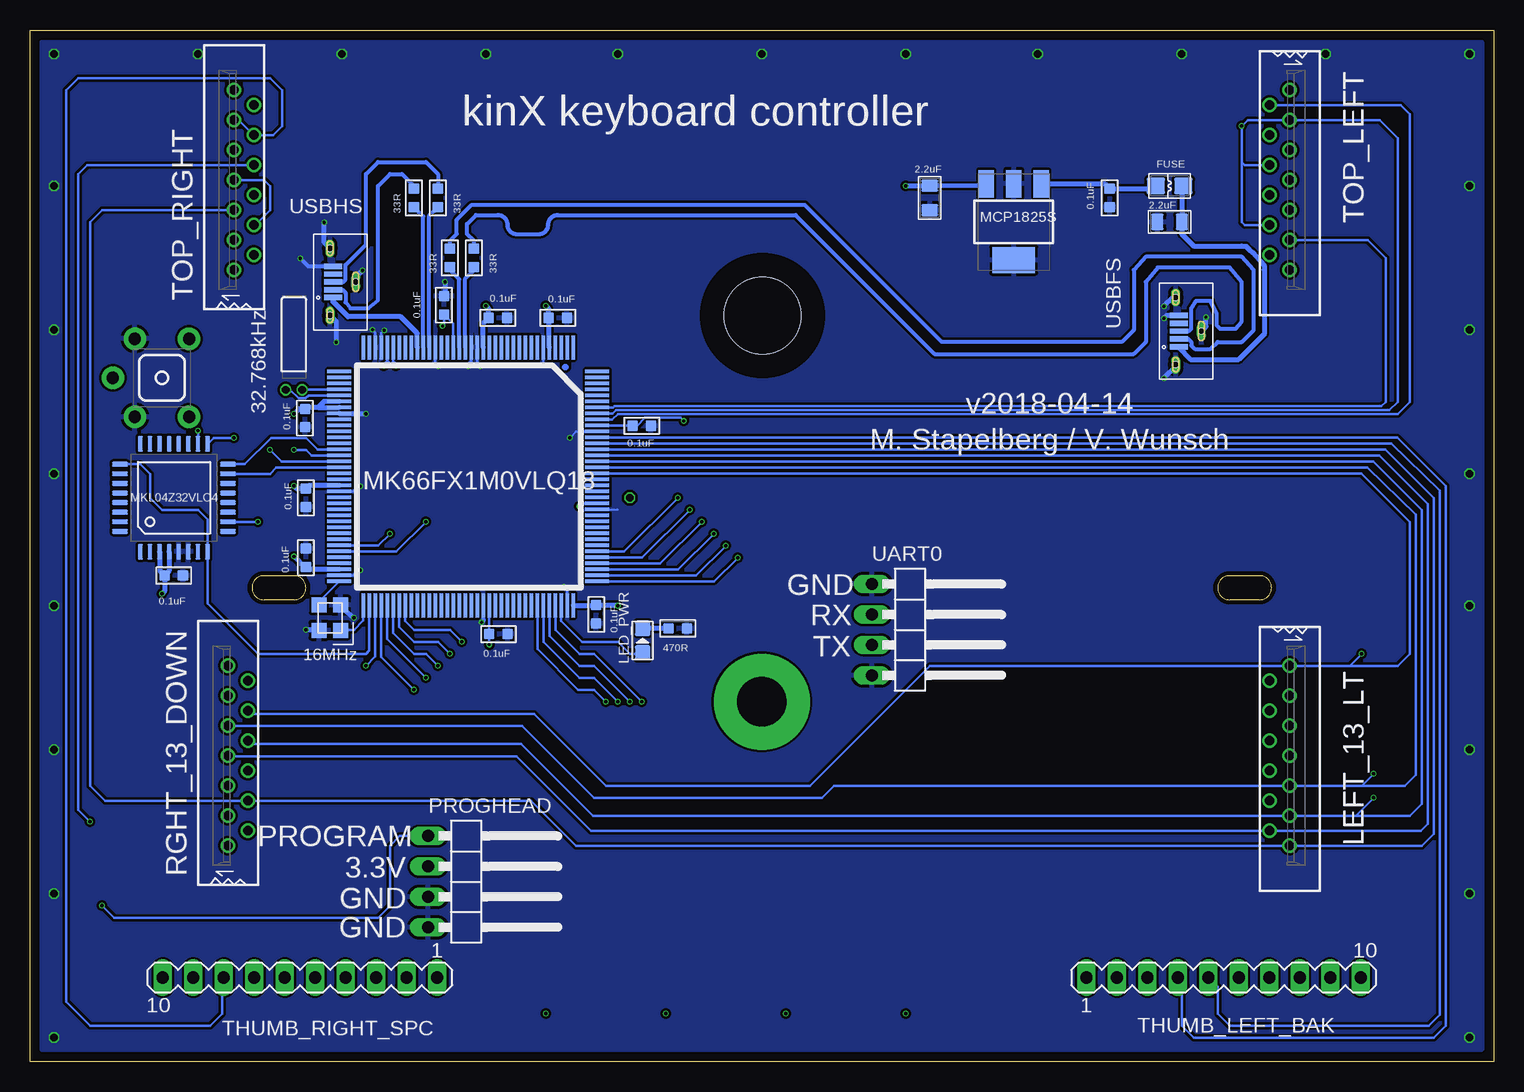
[diagram p7: board, bottom side, seen from below]

Size 122 x 86 mm. Coordinates in mm from the lower left corner, seen from the top.
Outline: 0,0 122,0 122,86 0,86 0,0
Outline: 19.5,38.5 22,38.5 arc90 23,39.5 arc90 22,40.5 19.5,40.5 arc90 18.5,39.5 arc90 19.5,38.5
Outline: 100,38.5 102.5,38.5 arc90 103.5,39.5 arc90 102.5,40.5 100,40.5 arc90 99,39.5 arc90 100,38.5
Copper layers (1*2*15*16): Top 0.035559375mm / dielectric 0.17018125mm / Route2 0.01778125mm / dielectric 47mil / Route15 0.01778125mm / dielectric 0.17018125mm / Bottom 0.035559375mm
Design rules "oshpark-4layer": minimum track width 5mil, minimum drill 10mil, track to track 5mil, track to pad 5mil, pad to pad 5mil, via to via 5mil, smd to smd 5mil, copper to edge 15mil, drill to drill 6mil, minimum pad ring 4mil, minimum via ring 4mil, stop-mask expansion 2.5mil, vias tented up to drill 0mil, thermal gap 10mil
Holes 6.4 mm at 60.94,62.17
tKeepout: area 55.9,57.2 to 65.9,67.2
bKeepout: area 55.9,57.2 to 65.9,67.2
tRestrict: area 55.9,57.2 to 65.9,67.2
bRestrict: area 55.9,57.2 to 65.9,67.2
vRestrict: area 55.9,57.2 to 65.9,67.2

### Footprints (pad centres in the part's own frame; a part is rotated, then mirrored left to right if it is on the bottom)
C0603 = smd 0.889 x 0.889: 1 0,0.762; 2 0,-0.762
C0805 = smd 1.397 x 1.016: 1 0,1.016; 2 0,-1.016
FHXXX = smd 1.27 x 1.27: 1 -1.052,-0.902; 2 1.052,-0.902; 3 1.052,0.902; 4 -1.052,0.902
TC26H = drill 0.635: 1 -0.686,0; 2 0.686,0
4,1-PAD = drill 4.1 pad 8: B4,1 0,0
SML1206 = smd 1.5 x 1.5: A 1.75,0; C -1.75,0
LED-0805 = smd 1.27 x 1.27: + -1.016,0; - 1.016,0
39-53-2135 = drill 0.8: P$1 -7.5,0; P$2 -6.25,-1.65; P$3 -5,0; P$4 -3.75,-1.65; P$5 -2.5,0; P$6 -1.25,-1.65; P$7 0,0; P$8 1.25,-1.65; P$9 2.5,0; P$10 3.75,-1.65; P$11 5,0; P$12 6.25,-1.65; P$13 7.5,0
LQFP32-08 = smd 1.3 x 0.4: 1 -4.493,2.8; 2 -4.493,2; 3 -4.493,1.2; 4 -4.493,0.4; 5 -4.493,-0.4; 6 -4.493,-1.2; 7 -4.493,-2; 8 -4.493,-2.8; 17 4.493,-2.8; 18 4.493,-2; 19 4.493,-1.2; 20 4.493,-0.4; 21 4.493,0.4; 22 4.493,1.2; 23 4.493,2; 24 4.493,2.8 | smd 0.4 x 1.3: 9 -2.8,-4.493; 10 -2,-4.493; 11 -1.2,-4.493; 12 -0.4,-4.493; 13 0.4,-4.493; 14 1.2,-4.493; 15 2,-4.493; 16 2.8,-4.493; 25 2.8,4.493; 26 2,4.493; 27 1.2,4.493; 28 0.4,4.493; 29 -0.4,4.493; 30 -1.2,4.493; 31 -2,4.493; 32 -2.8,4.493
1X04/90 = drill 1.016 long: 1 -3.81,-3.81; 2 -1.27,-3.81; 3 1.27,-3.81; 4 3.81,-3.81
R1206 = smd 1.6 x 1.803: 1 -1.422,0; 2 1.422,0
R0603 = smd 0.889 x 0.889: 1 0,0.762; 2 0,-0.762
F0805 = smd 1.397 x 1.524: 1 0,1.143; 2 0,-1.143
ALPS_SKHH = drill 1.016 pad 1.88: 1 -3.251,2.261; 2 3.251,2.261; 3 -3.251,-2.261; 4 3.251,-2.261; 5 0,-4.1
SOT-223 = smd 1.27 x 2.286: 1 -2.286,-3.175; 2 0,-3.175; 3 2.286,-3.175 | smd 3.556 x 2.159: PAD 0,3.175
MA10-1 = drill 1.016 long: 1 -11.43,0; 2 -8.89,0; 3 -6.35,0; 4 -3.81,0; 5 -1.27,0; 6 1.27,0; 7 3.81,0; 8 6.35,0; 9 8.89,0; 10 11.43,0
TQFP144 = smd 2 x 0.27: 1 -10.54,8.29; 2 -10.54,7.79; 3 -10.54,7.29; 4 -10.54,6.79; 5 -10.54,6.29; 6 -10.54,5.79; 7 -10.54,5.29; 8 -10.54,4.79; 9 -10.54,4.29; 10 -10.54,3.79; 11 -10.54,3.29; 12 -10.54,2.79; 13 -10.54,2.29; 14 -10.54,1.79; 15 -10.54,1.29; 16 -10.54,0.79; 17 -10.54,0.29; 18 -10.54,-0.21; 19 -10.54,-0.71; 20 -10.54,-1.21; 21 -10.54,-1.71; 22 -10.54,-2.21; 23 -10.54,-2.71; 24 -10.54,-3.21; 25 -10.54,-3.71; 26 -10.54,-4.21; 27 -10.54,-4.71; 28 -10.54,-5.21; 29 -10.54,-5.71; 30 -10.54,-6.21; 31 -10.54,-6.71; 32 -10.54,-7.21; 33 -10.54,-7.71; 34 -10.54,-8.21; 35 -10.54,-8.71; 36 -10.54,-9.21; 73 10.96,-9.21; 74 10.96,-8.71; 75 10.96,-8.21; 76 10.96,-7.71; 77 10.96,-7.21; 78 10.96,-6.71; 79 10.96,-6.21; 80 10.96,-5.71; 81 10.96,-5.21; 82 10.96,-4.71; 83 10.96,-4.21; 84 10.96,-3.71; 85 10.96,-3.21; 86 10.96,-2.71; 87 10.96,-2.21; 88 10.96,-1.71; 89 10.96,-1.21; 90 10.96,-0.71; 91 10.96,-0.21; 92 10.96,0.29; 93 10.96,0.79; 94 10.96,1.29; 95 10.96,1.79; 96 10.96,2.29; 97 10.96,2.79; 98 10.96,3.29; 99 10.96,3.79; 100 10.96,4.29; 101 10.96,4.79; 102 10.96,5.29; 103 10.96,5.79; 104 10.96,6.29; 105 10.96,6.79; 106 10.96,7.29; 107 10.96,7.79; 108 10.96,8.29 | smd 0.27 x 2: 37 -8.54,-11.21; 38 -8.04,-11.21; 39 -7.54,-11.21; 40 -7.04,-11.21; 41 -6.54,-11.21; 42 -6.04,-11.21; 43 -5.54,-11.21; 44 -5.04,-11.21; 45 -4.54,-11.21; 46 -4.04,-11.21; 47 -3.54,-11.21; 48 -3.04,-11.21; 49 -2.54,-11.21; 50 -2.04,-11.21; 51 -1.54,-11.21; 52 -1.04,-11.21; 53 -0.54,-11.21; 54 -0.04,-11.21; 55 0.46,-11.21; 56 0.96,-11.21; 57 1.46,-11.21; 58 1.96,-11.21; 59 2.46,-11.21; 60 2.96,-11.21; 61 3.46,-11.21; 62 3.96,-11.21; 63 4.46,-11.21; 64 4.96,-11.21; 65 5.46,-11.21; 66 5.96,-11.21; 67 6.46,-11.21; 68 6.96,-11.21; 69 7.46,-11.21; 70 7.96,-11.21; 71 8.46,-11.21; 72 8.96,-11.21; 109 8.96,10.29; 110 8.46,10.29; 111 7.96,10.29; 112 7.46,10.29; 113 6.96,10.29; 114 6.46,10.29; 115 5.96,10.29; 116 5.46,10.29; 117 4.96,10.29; 118 4.46,10.29; 119 3.96,10.29; 120 3.46,10.29; 121 2.96,10.29; 122 2.46,10.29; 123 1.96,10.29; 124 1.46,10.29; 125 0.96,10.29; 126 0.46,10.29; 127 -0.04,10.29; 128 -0.54,10.29; 129 -1.04,10.29; 130 -1.54,10.29; 131 -2.04,10.29; 132 -2.54,10.29; 133 -3.04,10.29; 134 -3.54,10.29; 135 -4.04,10.29; 136 -4.54,10.29; 137 -5.04,10.29; 138 -5.54,10.29; 139 -6.04,10.29; 140 -6.54,10.29; 141 -7.04,10.29; 142 -7.54,10.29; 143 -8.04,10.29; 144 -8.54,10.29
MOLEX_105133-0001 = smd 0.45 x 1.5: 1 -1.3,-0.25; 2 -0.65,-0.25; 3 0,-0.25; 4 0.65,-0.25; 5 1.3,-0.25 | drill 0.5 long: P$1 -2.8,0; P$2 2.8,0; P$3 0,-2.15 | hole 0.5: -2.8,0; 2.8,0; 0,-2.15

### Placement (x,y rotation side)
C1  32,72 0 bottom
C2  47,72 0 bottom
C3  27,70 270 bottom
C4  83,62 90 bottom
C5  78,62 90 bottom
C6  74.79,37.29 0 bottom
C7  71,53 90 bottom
C8  82.96,35.63 90 bottom
C9  99,42 180 bottom
C10  99.08,53.64 0 bottom
C11  99,47 0 bottom
C12  110.01,40.52 90 bottom
C13  87.5,63.05 180 bottom
G1  97,37 90 bottom
G2  100,56 0 bottom
H1  61,30 0 top
LED1  46,4 0 top
LED2  56,4 0 top
LED3  66,4 0 top
LED4  76,4 0 top
LED_PWR  70.93,35.09 90 bottom
LEFT_13_LT  17,25.5 270 bottom
MKL04Z32VLC4  110,47 90 bottom
PROGHEAD  85,15 270 bottom
R1  44,9 90 top
R2  54,9 90 top
R3  64,9 90 top
R4  74,9 90 top
R5  87,67 0 bottom
R6  88,72 0 bottom
R7  85,67 0 bottom
R8  68,36.1 270 bottom
R9  90,72 0 bottom
R12  27,73 270 bottom
RGHT_13_DOWN  105.5,25.5 90 bottom
S1  111,57 270 bottom
T1  40,70 180 bottom
THUMB_LEFT_BAK  22.5,7 0 bottom
THUMB_RIGHT_SPC  99.5,7 180 bottom
TOP_LEFT  17,73.5 270 bottom
TOP_RIGHT  105,73.5 90 bottom
U$1  85,49 270 bottom
UART0  48,36 270 bottom
USBFS  26.5,60.9 90 bottom
USBHS  97,65 90 bottom

### Tracks (layer width: path | path; a pad name or v marks a point on that pad's centre or on a via)
+3V3  (via drill 0.25)
  Top 0.4: LED2.A v59,4 | LED3.A v69,4 | LED4.A v79,4 | LED1.A v49,4
  Bottom 0.2: U$1.31 91.71,58.21 | U$1.32 92.21,58.29 | U$1.122 75.96,46.54 | 96.96,55.04 U$1.42 | U$1.94 C8.1 83.72,35.28 v83.72,34.76 | 72,53.04 U$1.135 | 72,53.04 71.8,53.04 | v67.49,53.4 v67.5,53.4 67.77,53.67 68.33,53.67 70.71,53.67 71.38,53 C7.1 71.96,53 72,53.04 | U$1.21 86.71,61.5 C13.1 87.5,61.44 v87.62,61.32 v87.61,61.32
  Bottom 0.4: 91.71,58.21 v91.5,58 | 92.21,58.29 v92.5,58 | 75.96,46.54 v76.2,46.3 | MKL04Z32VLC4.3 111.2,40.95 C12.1 | MKL04Z32VLC4.4 110.4,40.9 C12.1 | C12.1 110.77,39.23 v111,39 | T1.3 42.46,73 C2.1 47.02,73 v49,73 | U$1.70 98.8,41.04 C9.1 99.13,41.24 v100,42.11 | U$1.56 98.72,48.04 C11.1 99.76,47.76 v100,48 | U$1.5 78.71,61.95 C5.1 78.76,62.76 v79,63 | U$1.16 84.21,61.55 C4.1 83.76,62.76 v84,63 | 98,54.54 U$1.43 | 98,54.54 98.94,54.54 C10.1 99.59,54.41 v100,54 | U$1.42 97.5,55.04 98,54.54 | U$1.108 74.8,38.04 C6.1 73.05,38.05 v73,38
  pour Route15: 1,85 1,1 121,1 121,80 121,85
COL0  (via drill 0.25)
  Top 0.2: TOP_LEFT.P$8 12.25,72.25 12,72 12,47 11,46 v11,34
  Bottom 0.2: 12,33 LEFT_13_LT.P$1 47,33 57,23 74,23 80,29 103.6,29 RGHT_13_DOWN.P$10 | 12,33 8,33 7,34 7,45 11.04,49.04 U$1.127 | v11,34 12,33
COL1  (via drill 0.25)
  Top 0.2: TOP_LEFT.P$5 12,76 11,75 11,47 10,46 v10,24
  Bottom 0.2: RGHT_13_DOWN.P$9 81,28 75,22 56,22 55,23 LEFT_13_LT.P$9 11,23 | 11,23 7.4,23 6.5,23.9 6.5,45.6 10.54,49.54 U$1.128 | v10,24 11,23
COL2  (via drill 0.25)
  Top 0.2: v10,22 9,23 9,46 10,47 10,80 11,81 TOP_LEFT.P$1
  Bottom 0.2: RGHT_13_DOWN.P$8 103.57,26.47 81.04,26.47 75.07,20.5 LEFT_13_LT.P$11 11.5,20.5 | 11.5,20.5 7,20.5 6,21.5 6,46 10.04,50.04 U$1.129 | v10,22 11.5,20.5
COL3  (via drill 0.25)
  Top 0.2: v117,20 116,20 115,21 115,24 113.5,25.5 RGHT_13_DOWN.P$7
  Bottom 0.2: RGHT_13_DOWN.P$7 105.46,25.46 81.45,25.46 75.24,19.25 LEFT_13_LT.P$12 6.05,19.25 5.5,19.8 5.5,46.5 9.54,50.54 U$1.130 | TOP_RIGHT.P$8 117.25,74.75 118,74 118,21 v117,20
COL4
  Bottom 0.2: U$1.131 9.04,51.04 5,47 5,19 6,18 LEFT_13_LT.P$13 76.5,18 80.25,21.75 RGHT_13_DOWN.P$4 115.75,21.75 117,23 117,70 116,71 TOP_RIGHT.P$5
COL5
  Top 0.2: THUMB_LEFT_BAK.5 23.77,2.23 24.5,1.5 105,1.5 105.85,2.35 THUMB_RIGHT_SPC.8
  Bottom 0.2: TOP_RIGHT.P$11 104.6,78.5 TOP_RIGHT.P$10 101.75,77.25 101,78 101,81 102,82 118,82 119,81 119,5 117,3 107,3 106,4 106,6.85 THUMB_RIGHT_SPC.8 | THUMB_LEFT_BAK.5 23,6.23 23,4 22,3 5.4,3 4.5,3.9 4.5,47.6 8.54,51.54 U$1.132
COL6
  Top 0.2: THUMB_LEFT_BAK.4 26.31,2.69 27,2 102,2 103.31,3.31 THUMB_RIGHT_SPC.7
  Bottom 0.2: THUMB_LEFT_BAK.4 26,6.69 26,3 25,2 5,2 4,3 4,48 8.04,52.04 U$1.133
D0_N
  Bottom 0.35: R5.1 87,68.42 86.42,69 86.42,70.18 85.18,71.42 57.42,71.42 46,60 31,60 30,61 30,66 29,67.1 21,67.1 20,66 20,61 21,60 23,60 23.6,59.4 24.9,59.4 25.2,59.7 25.2,60 25.45,60.25 USBFS.2
D0_P
  Bottom 0.35: R7.1 85,68.42 85.58,69 85.58,69.82 84.82,70.58 83,70.58 arc90 82.2,69.78 arc-90 81.4,68.97 79.6,68.97 arc-90 78.8,69.78 arc90 78,70.58 58.18,70.58 46.6,59 30,59 29,60 29,65 28,66.2 22,66.2 21,65 21,61.7 21.5,61.1 22.8,61.1 23.07,61.37 23.07,62.37 23.6,63.4 24.8,63.4 25.2,62.8 25.2,61.1 25.4,60.9 USBFS.3
D0F_N
  Bottom 0.35: U$1.20 86.21,65.21 87,66 R5.2
D0F_P
  Bottom 0.35: U$1.19 85.71,65.29 85,66 R7.2
D1_N
  Bottom 0.35: R9.1 90,73 91,74 92,74 93,73 93,63.5 93.8,62.8 95.3,62.8 95.7,63.3 95.7,64.1 95.95,64.35 USBHS.2
D1_P
  Bottom 0.35: USBHS.3 95.9,65 95.7,65.2 95.7,66.4 94,68.1 94,74 93,75 89,75 88,74 R6.1
D1F_N
  Bottom 0.35: U$1.26 89.21,70.45 R9.2
D1F_P
  Bottom 0.35: U$1.25 88.71,70.53 R6.2
GND  (via drill 0.25, 0.6)
  Bottom 0.152: U$1.121 73.04,46.04 73,46 | U$1.6 79.21,58.21 79,58
  Bottom 0.2: 96.96,54.04 U$1.44 | 92.71,60.29 U$1.33 92.71,60.72 v92.47,60.96 | U$1.34 93.21,60.79 v93.44,61.02 | U$1.93 84.21,36.83 | 84.39,36.69 v84.37,36.62 | U$1.107 77.21,39.29 v77.49,39.57 v77.5,39.57 | U$1.134 76.46,52.54 v77,52 | U$1.17 84.71,58.2 | U$1.71 94.89,40.54 | U$1.57 94.89,47.54 | U$1.24 88.21,58.2 v87.97,57.96 | U$1.18 85.21,58.22
  Bottom 0.35: USBHS.5 98.81,66.3 v99.47,66.96
  Bottom 0.4: 84.21,36.83 v84.37,36.62 | G1.2 96.15,38 v95,37 | G1.4 97.85,36 v99,36 | U$1.44 94.04,54.04 v94,54 | 84.71,58.2 v84.47,57.96 | 94.89,40.54 v94.47,40.96 | 94.89,47.54 v94.47,47.96 | v87.4,65 87.4,63.91 C13.2 | USBHS.P$3 94.85,65.38 v94.27,65.96 | USBHS.P$2 97.47,68.27 v97.47,69.96 | USBHS.P$1 96.47,61.67 v96.47,59.96 | 85.21,58.22 v85.47,57.96 | USBFS.P$2 26.73,63.7 v27.47,62.96 | USBFS.5 27.23,62.2 v27.47,61.96 | USBFS.P$1 26.5,57.93 v27.47,56.96 | USBFS.P$3 23.97,61.28 v23.97,62.06
  other vias: 2,2 120,2 120,84 2,84 61,84 26,84 38,84 14,84 73,84 49,84 96,84 84,84 108,84 120,61 120,73 120,49 120,26 120,38 120,14 2,26 2,38 2,14 2,61 2,73 2,49
  pour Top (isolate 0.203): 1,85 1,1 121,1 121,85
  pour Route2: 1,85 1,1 121,1 121,85
  pour Bottom (isolate 0.203): 1,85 1,1 121,1 121,85
LED_CAPS_LOCK  (via drill 0.25)
  Top 0.2: v71,30 71,18 70,17 45,17 44,16 R1.2
  Bottom 0.2: U$1.105 78.2,38.28 78.2,36 76.2,34 75,34 v71,30
LED_KEYPAD  (via drill 0.25)
  Top 0.2: v74,30 R4.2
  Bottom 0.2: U$1.102 79.7,38.28 79.7,34.4 76.3,31 75,31 v74,30
LED_NUM_LOCK  (via drill 0.25)
  Top 0.2: v72,30 72,17 71,16 55,16 54,15 R2.2
  Bottom 0.2: U$1.104 78.7,38.28 78.7,35.5 76.2,33 75,33 v72,30
LED_SCROLL_LOCK  (via drill 0.25)
  Top 0.2: v73,30 73,16 72,15 65,15 64,14 R3.2
  Bottom 0.2: U$1.103 79.2,38.28 79.2,35 76.2,32 75,32 v73,30
N$1  (via drill 0.6)
  other vias: 72,47
N$7
  Bottom 0.4: 37.54,73 T1.1 32.41,73.17 C1.1 28.13,72.76 R12.2
N$14
  Top 0.4: LED4.C 74,4.25 R4.1
N$15
  Top 0.4: LED3.C 64,4.25 R3.1
N$16
  Top 0.4: LED2.C 54,4.25 R2.1
N$17
  Top 0.4: LED1.C 44,4.25 R1.1
N$18
  Bottom 0.2: U$1.73 94.21,36.79 95,36 96.15,36 G1.1
N$19
  Bottom 0.2: U$1.72 97.78,38.48 G1.3
N$20
  Bottom 0.2: U$1.40 99.27,56.04 G2.2
N$21
  Bottom 0.2: G2.1 100.31,56 99.61,55.3 99.02,55.3 98.78,55.54 U$1.41
N$41
  Bottom 0.2: U$1.106 77.71,36.71 76,35 73,35 72,34 71.14,34 LED_PWR.+
N$70  (via drill 0.25)
  Top 0.2: S1.1 S1.2 | S1.2 108,53.01 v108,52.59 | v116,13 118.49,15.49 118.49,53.96 117.45,55 111,55 109.75,53.75 S1.2
  Bottom 0.2: v108,52.59 MKL04Z32VLC4.18 | PROGHEAD.1 91.19,18.81 92,18 92,13 93,12 115,12 v116,13
N$80
  Bottom 0.4: R8.2 LED_PWR.-
PTA1  (via drill 0.25)
  Top 0.2: v100,51 101,51 102,50 102,46 v103,45
  Bottom 0.2: U$1.51 98.54,50.54 99,51 v100,51 | v103,45 MKL04Z32VLC4.10
PTA2  (via drill 0.25)
  Top 0.2: v102,51 103,52 v105,52
  Bottom 0.2: U$1.52 101.04,50.04 v102,51 | v105,52 106.69,52 MKL04Z32VLC4.17
RESET_B
  Bottom 0.2: U$1.74 93.71,34.29 94,34 103,34 107.2,38.2 MKL04Z32VLC4.8 107.2,45.2 108,46 111,46 112,47 112,49 112.8,49.8 MKL04Z32VLC4.25
ROW_0  (via drill 0.25)
  Top 0.2: v94,33 RGHT_13_DOWN.P$13
  Bottom 0.2: U$1.75 93.21,33.79 v94,33
ROW_1  (via drill 0.25)
  Top 0.2: LEFT_13_LT.P$7 14.5,25.5 13,27 13,43 16,46 v67,46
  Bottom 0.2: U$1.113 70.96,42.04 v67,46
ROW_2  (via drill 0.25)
  Top 0.2: THUMB_LEFT_BAK.8 16.15,12.15 17,13 20,13 21,14 21,26 20.25,26.75 LEFT_13_LT.P$6 14.25,26.75 13.5,27.3 13.5,42.3 16.2,45 v66,45
  Bottom 0.2: U$1.112 69.46,41.54 v66,45
ROW_3  (via drill 0.25)
  Top 0.2: THUMB_LEFT_BAK.3 29,7.15 29,29 28.75,29.25 LEFT_13_LT.P$4 14.75,29.25 14,30 14,42 16,44 v65,44
  Bottom 0.2: U$1.111 67.96,41.04 v65,44
ROW_4  (via drill 0.25)
  Top 0.2: THUMB_LEFT_BAK.2 31.39,29.61 30.5,30.5 LEFT_13_LT.P$3 15.5,30.5 14.5,31.6 14.5,41.6 15.9,43 v64,43
  Bottom 0.2: U$1.110 66.46,40.54 v64,43
ROW_5  (via drill 0.25)
  Top 0.2: THUMB_LEFT_BAK.1 34,7.07 34,31 33.25,31.75 LEFT_13_LT.P$2 18.4,32 16,32 15,33 15,41 16,42 v63,42
  Bottom 0.2: U$1.109 64.96,40.04 v63,42
ROW_6  (via drill 0.25)
  Top 0.2: RGHT_13_DOWN.P$1 102,18 100.77,16.77 THUMB_RIGHT_SPC.6 100.77,3.77 100,3 83,3 81,5 81,33 82,34 85,34 v86,35
  Bottom 0.2: v86,35 87,36 90,36 90.71,36.71 U$1.80
ROW_7  (via drill 0.25)
  Top 0.2: RGHT_13_DOWN.P$3 96.5,20.5 95.69,19.69 THUMB_RIGHT_SPC.4 95.69,4.69 95,4 84,4 83,5 83,31 84,32 87,32 v88,33
  Bottom 0.2: U$1.78 91.71,35.71 90,34 89,34 v88,33
ROW_8  (via drill 0.25)
  Top 0.2: RGHT_13_DOWN.P$2 103.6,19 99,19 98,18 98,7.23 THUMB_RIGHT_SPC.5 98.23,3.87 97.86,3.5 83.5,3.5 82,5 82,32 83,33 86,33 v87,34
  Bottom 0.2: U$1.79 91.21,36.21 90,35 88,35 v87,34
ROW_9  (via drill 0.25)
  Top 0.2: RGHT_13_DOWN.P$12 103.6,32 94,32 93.15,30.85 THUMB_RIGHT_SPC.3 93.15,5.93 92.21,4.99 86.01,4.99 85,6 85,29 86,30 89,30 v90,31
  Bottom 0.2: U$1.76 92.71,33.71 v90,31
ROW_EQL  (via drill 0.25)
  Top 0.2: LEFT_13_LT.P$8 13.75,24.25 12.5,25.3 12.5,43.5 16,47 v68,47
  Bottom 0.2: U$1.114 72.46,42.54 v68,47
ROW_ESC
  Top 0.2: TOP_LEFT.P$2 20.75,79.75 23,82 94,82 100,76 TOP_RIGHT.P$9
  Bottom 0.2: TOP_LEFT.P$2 7.75,79.75 7,79 7,55 8,54 73,54 73.46,53.54 U$1.136
ROW_F1  (via drill 0.25)
  Top 0.2: TOP_RIGHT.P$3 106.5,68.5 107,69 107,72 | TOP_RIGHT.P$13 106,81 107,80 107,72 | 107,72 103.6,72 TOP_RIGHT.P$6 103.35,72.65 101,75 100,75 94,81 24,81 v21,78
  Bottom 0.2: TOP_LEFT.P$10 20.75,69.75 21,70 21,75 | 21,75 v21,78 20.5,78.5 TOP_LEFT.P$3 9.5,78.5 8,77 8,55 8.67,54.33 68,54.33 | TOP_LEFT.P$6 20.75,74.75 21,75 | 74.92,54 U$1.137 73.42,54.04 73.14,54.33 68,54.33 | 68,54.33 67.33,54.33
ROW_F2
  Top 0.2: TOP_LEFT.P$11 19.5,68.5 20,69 20,73.2 19.7,73.5 | TOP_RIGHT.P$7 105.5,73.5 106,74 106,79 105,80 103.6,80 TOP_RIGHT.P$12 | TOP_LEFT.P$4 19.75,77.25 | 19.75,77.25 20,77 20,73.8 19.7,73.5 | 19.7,73.5 TOP_LEFT.P$7 | 19.75,77.25 22.25,77.25 25,80 94,80 101,73 101,71 102.25,69.75 TOP_RIGHT.P$4
  Bottom 0.2: TOP_RIGHT.P$7 102.5,73.5 102,73 102,71 103.25,69.75 TOP_RIGHT.P$4 | 74.93,54.51 U$1.138 73.39,54.54 73.27,54.65 9.35,54.65 9,55 9,67 10.5,68.5 TOP_LEFT.P$11
ROW_MIN  (via drill 0.25)
  Top 0.2: RGHT_13_DOWN.P$6 95.7,24.25 94.51,23.06 94.51,5.83 93.13,4.45 84.55,4.45 84,5 84,30 85,31 88,31 v89,32
  Bottom 0.2: U$1.77 92.21,35.21 v89,32
RX  (via drill 0.25)
  Top 0.2: v89,45 73,45 67,39 56,39 54.27,37.27 UART0.2
  Bottom 0.2: U$1.67 91.46,42.54 v89,45
SWD_CLK
  Bottom 0.2: U$1.50 98.04,51.04 99,52 101.89,52 104.09,49.8 MKL04Z32VLC4.16
SWD_DIO
  Bottom 0.2: MKL04Z32VLC4.15 102,49 101.46,49.54 U$1.53
TX  (via drill 0.25)
  Top 0.2: v92,44 73,44 67,38 57,38 53.73,34.73 UART0.3
  Bottom 0.2: U$1.66 92.96,43.04 v92,44
USBFS_VBUS
  Bottom 0.4: R12.1 25.98,72.87 C3.1 25.98,68.98 25,68 21,68 21,67.98 20.98,67.97 20.64,67.97 20.62,67.96 20.6,67.96 20.37,67.7 20.12,67.46 19.12,66.36 19.12,66.34 19.11,66.32 19.12,65.98 19.12,60.64 21.24,58.52 25.26,58.52 26.25,59.51 USBFS.1
USBHS_VBUS
  Bottom 0.4: USBHS.1 96.75,63.35 95.5,62.1 91.1,62.1 89.71,60.71 U$1.27

### Text on the board
tNames: CAPS_LOCK | NUM_LOCK | KEYPAD | SCROLL_LOCK
bNames: kinX keyboard controller | v2018-04-14 | M. Stapelberg / V. Wunsch | GND | RX | TX | PROGRAM | 3.3V | GND | GND